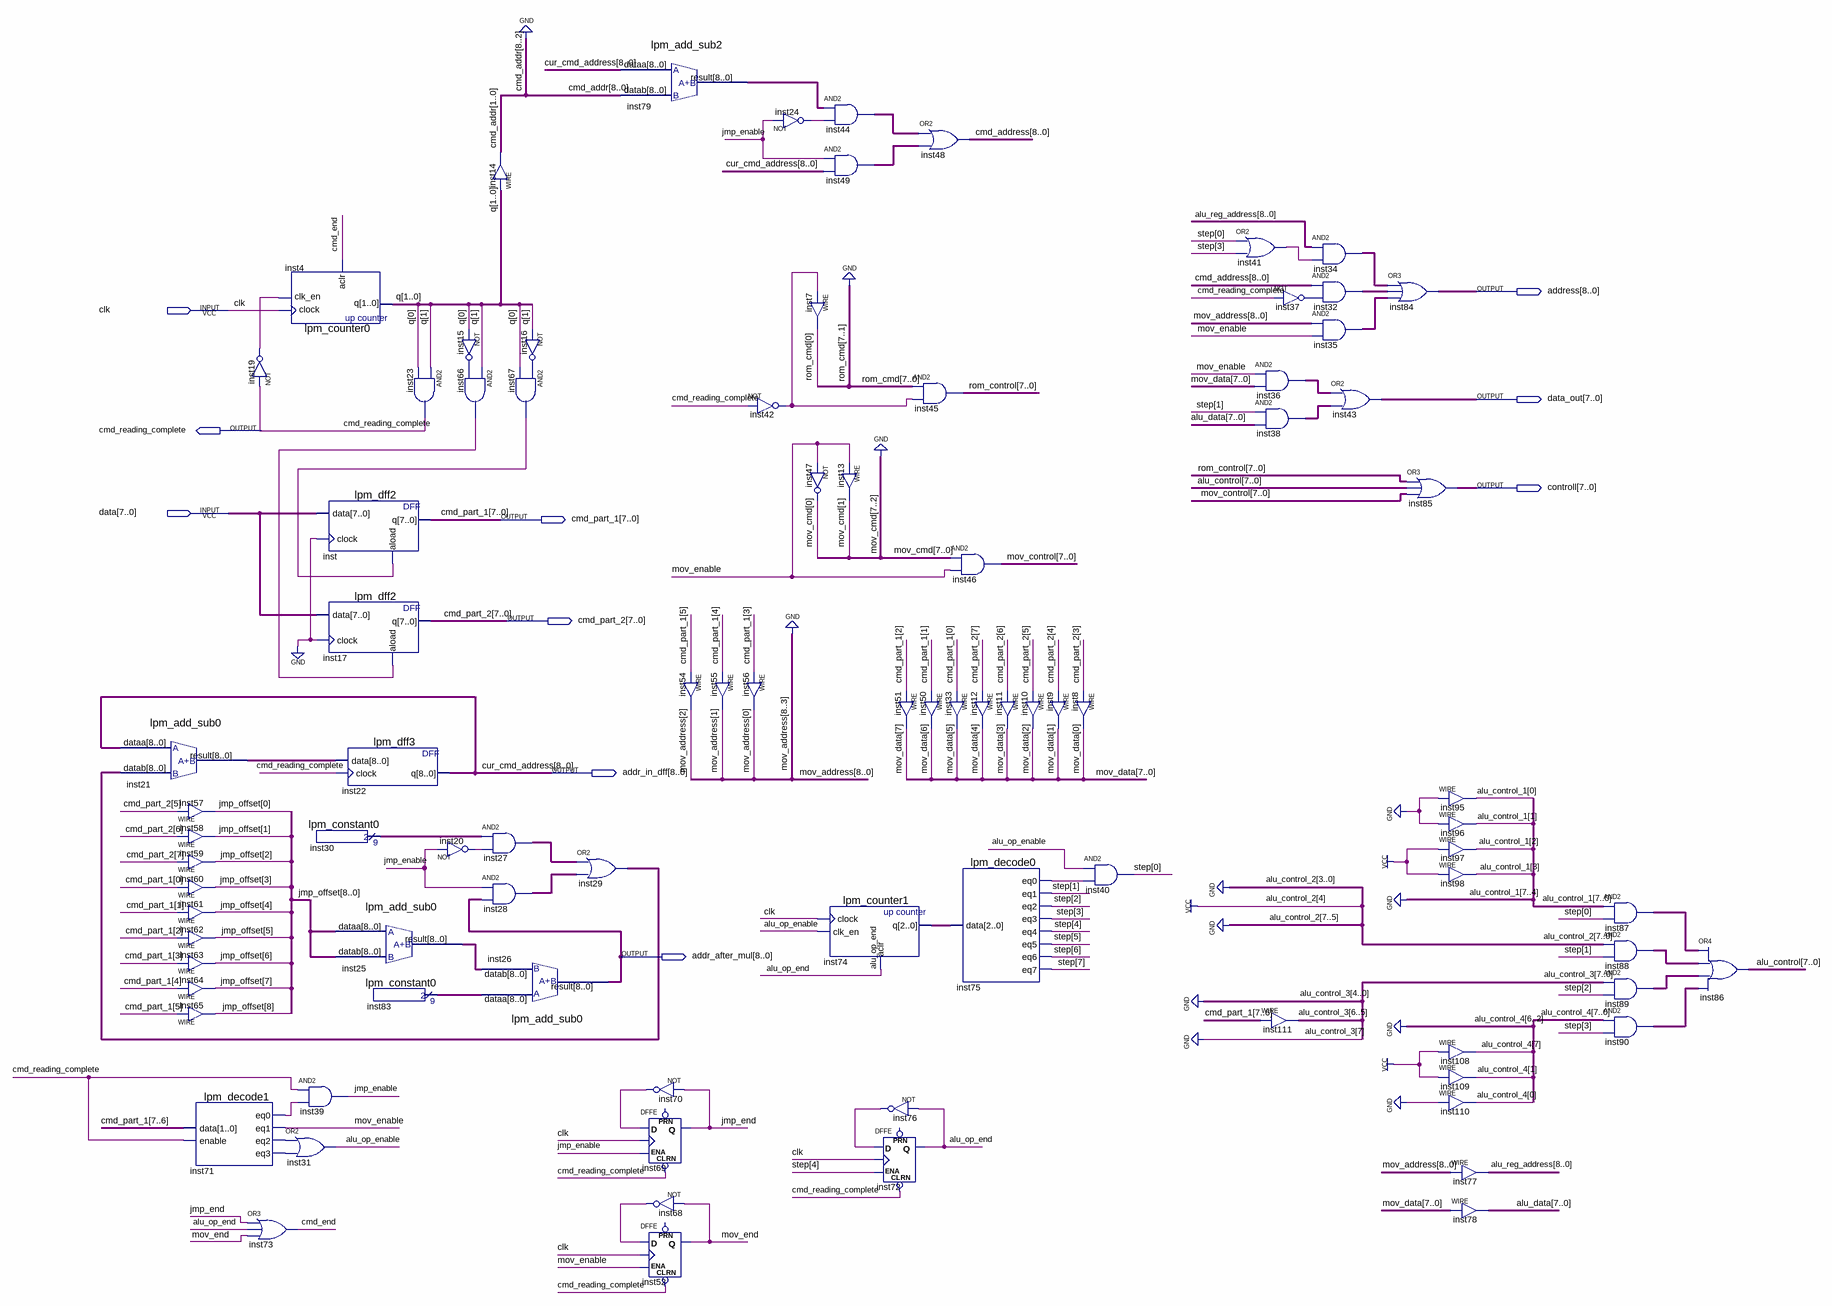
[diagram p0: schematic sheet]
// Quartus schematic ControllUnit.bdf as structural Verilog: 89 symbols, 10 pins
module ControllUnit (
  input  clk,
  input  [7:0] data,
  output [8:0] address,
  output [7:0] data_out,
  output cmd_reading_complete,
  output [7:0] controll,
  output [7:0] cmd_part_1,
  output [7:0] cmd_part_2,
  output [8:0] addr_in_dff,
  output [8:0] addr_after_mul
);

  wire alu_op_enable, alu_op_end, cmd_end, inst15_out, inst16_out, inst19_out, inst20_out, inst24_out,
       inst37_out, inst41_out, inst42_out, inst66_out, inst67_out, inst68_out, inst70_out, inst71_eq0,
       inst71_eq2, inst71_eq3, inst75_eq0, inst76_out, jmp_enable, jmp_end, mov_enable, mov_end;
  wire [0:0] rom_cmd;
  wire [1:0] cmd_addr, mov_cmd, q;
  wire [2:0] inst74_q, mov_address;
  wire [3:0] alu_control_1;
  wire [6:5] alu_control_3;
  wire [7:0] alu_control, alu_control_4, alu_data, inst36_out, inst38_out, inst87_out, inst88_out,
       inst89_out, inst90_out, mov_control, mov_data, rom_control, step;
  wire [8:0] alu_reg_address, cmd_address, inst21_result, inst25_result, inst27_out, inst28_out, inst29_out,
       inst30_result, inst32_out, inst34_out, inst35_out, inst44_out, inst49_out, inst79_result,
       inst83_result, jmp_offset;

  lpm_add_sub0 inst21 (.dataa(addr_in_dff), .datab(inst29_out), .result(inst21_result));
  assign jmp_offset[0] = cmd_part_2[5];  // WIRE inst57
  assign jmp_offset[1] = cmd_part_2[6];  // WIRE inst58
  assign jmp_offset[2] = cmd_part_2[7];  // WIRE inst59
  assign jmp_offset[3] = cmd_part_1[0];  // WIRE inst60
  assign jmp_offset[4] = cmd_part_1[1];  // WIRE inst61
  assign jmp_offset[5] = cmd_part_1[2];  // WIRE inst62
  assign jmp_offset[6] = cmd_part_1[3];  // WIRE inst63
  assign jmp_offset[7] = cmd_part_1[4];  // WIRE inst64
  assign jmp_offset[8] = cmd_part_1[5];  // WIRE inst65
  lpm_decode1 inst71 (
    .data(cmd_part_1[7:6]), .enable(cmd_reading_complete), .eq0(inst71_eq0), .eq1(mov_enable),
    .eq2(inst71_eq2), .eq3(inst71_eq3));
  lpm_counter0 inst4 (.clock(clk), .clk_en(inst19_out), .aclr(cmd_end), .q(q));
  not inst19 (inst19_out, cmd_reading_complete);
  or inst31 (alu_op_enable, inst71_eq2, inst71_eq3);
  or inst73 (cmd_end, jmp_end, alu_op_end, mov_end);
  lpm_dff2 inst (.data(data), .clock(1'b0), .aload(inst67_out), .q(cmd_part_1));
  lpm_dff2 inst17 (.data(data), .clock(1'b0), .aload(inst66_out), .q(cmd_part_2));
  lpm_dff3 inst22 (.data(inst21_result), .clock(cmd_reading_complete), .q(addr_in_dff));
  lpm_constant0 inst30 (.result(inst30_result));
  lpm_add_sub0 inst25 (.dataa(jmp_offset), .datab(jmp_offset), .result(inst25_result));
  and inst39 (jmp_enable, cmd_reading_complete, inst71_eq0);
  lpm_constant0 inst83 (.result(inst83_result));
  and inst23 (cmd_reading_complete, q[1], q[0]);
  not inst20 (inst20_out, jmp_enable);
  assign cmd_addr = q;  // WIRE inst14
  not inst15 (inst15_out, q[0]);
  and inst66 (inst66_out, q[1], inst15_out);
  assign inst27_out = inst30_result & {9{inst20_out}};  // AND2 inst27, 9 bits wide
  assign inst28_out = {9{jmp_enable}} & addr_after_mul;  // AND2 inst28, 9 bits wide
  lpm_add_sub0 inst26 (.dataa(inst83_result), .datab(inst25_result), .result(addr_after_mul));
  not inst16 (inst16_out, q[1]);
  and inst67 (inst67_out, inst16_out, q[0]);
  assign inst29_out = inst27_out | inst28_out;  // OR2 inst29, 9 bits wide
  lpm_add_sub2 inst79 (.dataa(addr_in_dff), .datab({{7{1'b0}}, cmd_addr}), .result(inst79_result));
  not inst70 (inst70_out, jmp_end);
  DFFE inst69 (.CLRN(cmd_reading_complete), .D(inst70_out), .CLK(clk), .ENA(jmp_enable), .Q(jmp_end));  // open: PRN
  not inst68 (inst68_out, mov_end);
  DFFE inst52 (.CLRN(cmd_reading_complete), .D(inst68_out), .CLK(clk), .ENA(mov_enable), .Q(mov_end));  // open: PRN
  assign mov_address[2] = cmd_part_1[5];  // WIRE inst54
  not inst42 (inst42_out, cmd_reading_complete);
  assign mov_address[1] = cmd_part_1[4];  // WIRE inst55
  assign mov_address[0] = cmd_part_1[3];  // WIRE inst56
  not inst24 (inst24_out, jmp_enable);
  assign inst44_out = inst79_result & {9{inst24_out}};  // AND2 inst44, 9 bits wide
  assign inst49_out = {9{jmp_enable}} & addr_in_dff;  // AND2 inst49, 9 bits wide
  assign rom_cmd[0] = inst42_out;  // WIRE inst7
  not inst47 (mov_cmd[0], mov_enable);
  assign mov_cmd[1] = mov_enable;  // WIRE inst13
  lpm_counter1 inst74 (.clock(clk), .clk_en(alu_op_enable), .aclr(alu_op_end), .q(inst74_q));
  assign mov_data[7] = cmd_part_1[2];  // WIRE inst51
  not inst76 (inst76_out, alu_op_end);
  DFFE inst72 (.CLRN(cmd_reading_complete), .D(inst76_out), .CLK(clk), .ENA(step[4]), .Q(alu_op_end));  // open: PRN
  assign cmd_address = inst44_out | inst49_out;  // OR2 inst48, 9 bits wide
  assign rom_control = {{7{1'b0}}, rom_cmd[0]} & {8{inst42_out}};  // AND2 inst45, 8 bits wide
  assign mov_control = {{6{1'b0}}, mov_cmd} & {8{mov_enable}};  // AND2 inst46, 8 bits wide
  assign mov_data[5] = cmd_part_1[0];  // WIRE inst33
  assign mov_data[6] = cmd_part_1[1];  // WIRE inst50
  lpm_decode0 inst75 (
    .data(inst74_q), .eq0(inst75_eq0), .eq1(step[1]), .eq2(step[2]), .eq3(step[3]), .eq4(step[4]),
    .eq5(step[5]), .eq6(step[6]), .eq7(step[7]));
  assign mov_data[3] = cmd_part_2[6];  // WIRE inst11
  assign mov_data[4] = cmd_part_2[7];  // WIRE inst12
  assign mov_data[1] = cmd_part_2[4];  // WIRE inst9
  assign mov_data[2] = cmd_part_2[5];  // WIRE inst10
  assign mov_data[0] = cmd_part_2[3];  // WIRE inst8
  and inst40 (step[0], alu_op_enable, inst75_eq0);
  or inst41 (inst41_out, step[0], step[3]);
  assign inst36_out = {8{mov_enable}} & mov_data;  // AND2 inst36, 8 bits wide
  assign inst38_out = {8{step[1]}} & alu_data;  // AND2 inst38, 8 bits wide
  not inst37 (inst37_out, cmd_reading_complete);
  assign alu_control_3 = cmd_part_1[7:6];  // WIRE inst111
  assign inst34_out = alu_reg_address & {9{inst41_out}};  // AND2 inst34, 9 bits wide
  assign inst32_out = cmd_address & {9{inst37_out}};  // AND2 inst32, 9 bits wide
  assign inst35_out = {{6{1'b0}}, mov_address} & {9{mov_enable}};  // AND2 inst35, 9 bits wide
  assign data_out = inst36_out | inst38_out;  // OR2 inst43, 8 bits wide
  assign address = inst34_out | inst32_out | inst35_out;  // OR3 inst84, 9 bits wide
  assign controll = rom_control | alu_control | mov_control;  // OR3 inst85, 8 bits wide
  assign alu_control_1[0] = 1'b0;  // WIRE inst95
  assign alu_control_1[1] = 1'b0;  // WIRE inst96
  assign alu_control_1[2] = 1'b1;  // WIRE inst97
  assign alu_control_1[3] = 1'b1;  // WIRE inst98
  assign alu_control_4[7] = 1'b1;  // WIRE inst108
  assign alu_control_4[1] = 1'b1;  // WIRE inst109
  assign alu_control_4[0] = 1'b0;  // WIRE inst110
  assign alu_reg_address = {{6{1'b0}}, mov_address};  // WIRE inst77
  assign alu_data = mov_data;  // WIRE inst78
  assign inst87_out = {4'b0000, alu_control_1} & {8{step[0]}};  // AND2 inst87, 8 bits wide
  assign inst88_out = 8'b00010000 & {8{step[1]}};  // AND2 inst88, 8 bits wide
  assign inst89_out = {1'b0, alu_control_3, {5{1'b0}}} & {8{step[2]}};  // AND2 inst89, 8 bits wide
  assign inst90_out = {alu_control_4[7], {5{1'b0}}, alu_control_4[1:0]} & {8{step[3]}};  // AND2 inst90, 8 bits wide
  assign alu_control = inst87_out | inst88_out | inst89_out | inst90_out;  // OR4 inst86, 8 bits wide

  // Other names for the same wires on the sheet: cur_cmd_address[8:0] = addr_in_dff
endmodule
